# EAGLE schematic rc_controller_reciever (EAGLE 9.6.2)

## Sheet 1 of 2
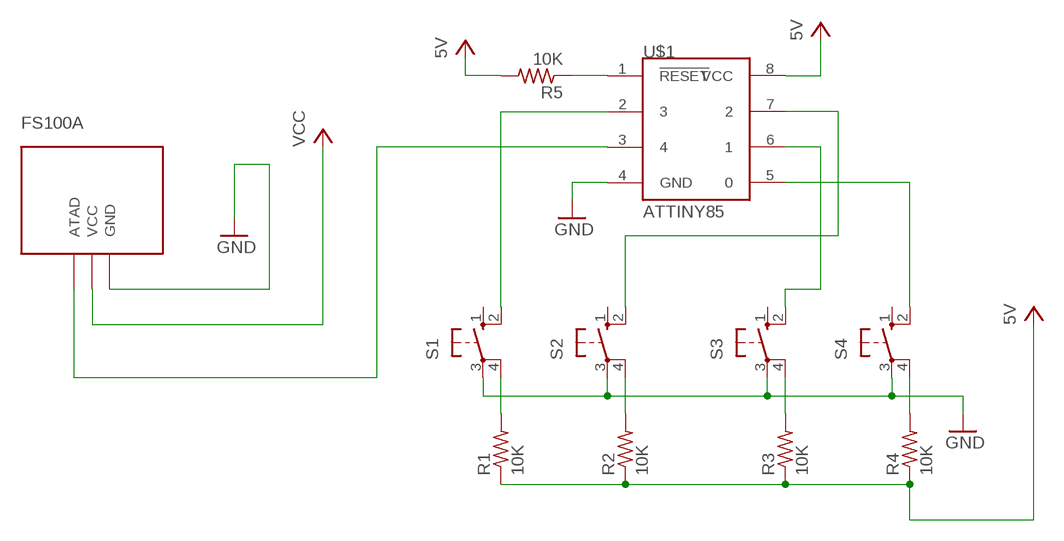
[diagram p0: schematic, sheet 1]

### Parts
R1  10K  R-US_0204/5  [0204/5]
R2  10K  R-US_0204/5  [0204/5]
R3  10K  R-US_0204/5  [0204/5]
R4  10K  R-US_0204/5  [0204/5]
R5  10K  R-US_0204/5  [0204/5]
S1  10-XX  [B3F-10XX]
S2  10-XX  [B3F-10XX]
S3  10-XX  [B3F-10XX]
S4  10-XX  [B3F-10XX]
U$1  ATTINY85  [8P3]
U$2  FS100A  (no package)

### Nets
GND: S1.3(P) S2.3(P) S3.3(P) S4.3(P) U$1.4(GND) U$2.GND
N$1: R5.1 U$1.1(!RESET)
N$2: R1.2 S1.4(P1)
N$3: R2.2 S2.4(P1)
N$4: R3.2 S3.4(P1)
N$5: R4.2 S4.4(P1)
N$7: S1.2(S1) U$1.2
N$8: S2.2(S1) U$1.7
N$9: S3.2(S1) U$1.6
N$10: S4.2(S1) U$1.5
TO_TRANSMITTER: U$1.3 U$2.ATAD
VCC: R1.1 R2.1 R3.1 R4.1 R5.2 U$1.8(VCC) U$2.VCC ; supply symbol labelled 5V
Unconnected: S1.1(S) S2.1(S) S3.1(S) S4.1(S)

## Sheet 2 of 2

## Library data of the parts
R1-R5 = rcl:R-US_: RESISTOR, American symbol; SPICEPREFIX: R
S1-S4 = switch-omron:10-XX: OMRON SWITCH; MPN: B3F-1000; OC_FARNELL: 176432; OC_NEWARK: 36M3542
U$1 = attiny85:ATTINY85
U$2 = mylibrary:FS100A